# EAGLE design Pr0board_Lite_Main (EAGLE 9.6.2)
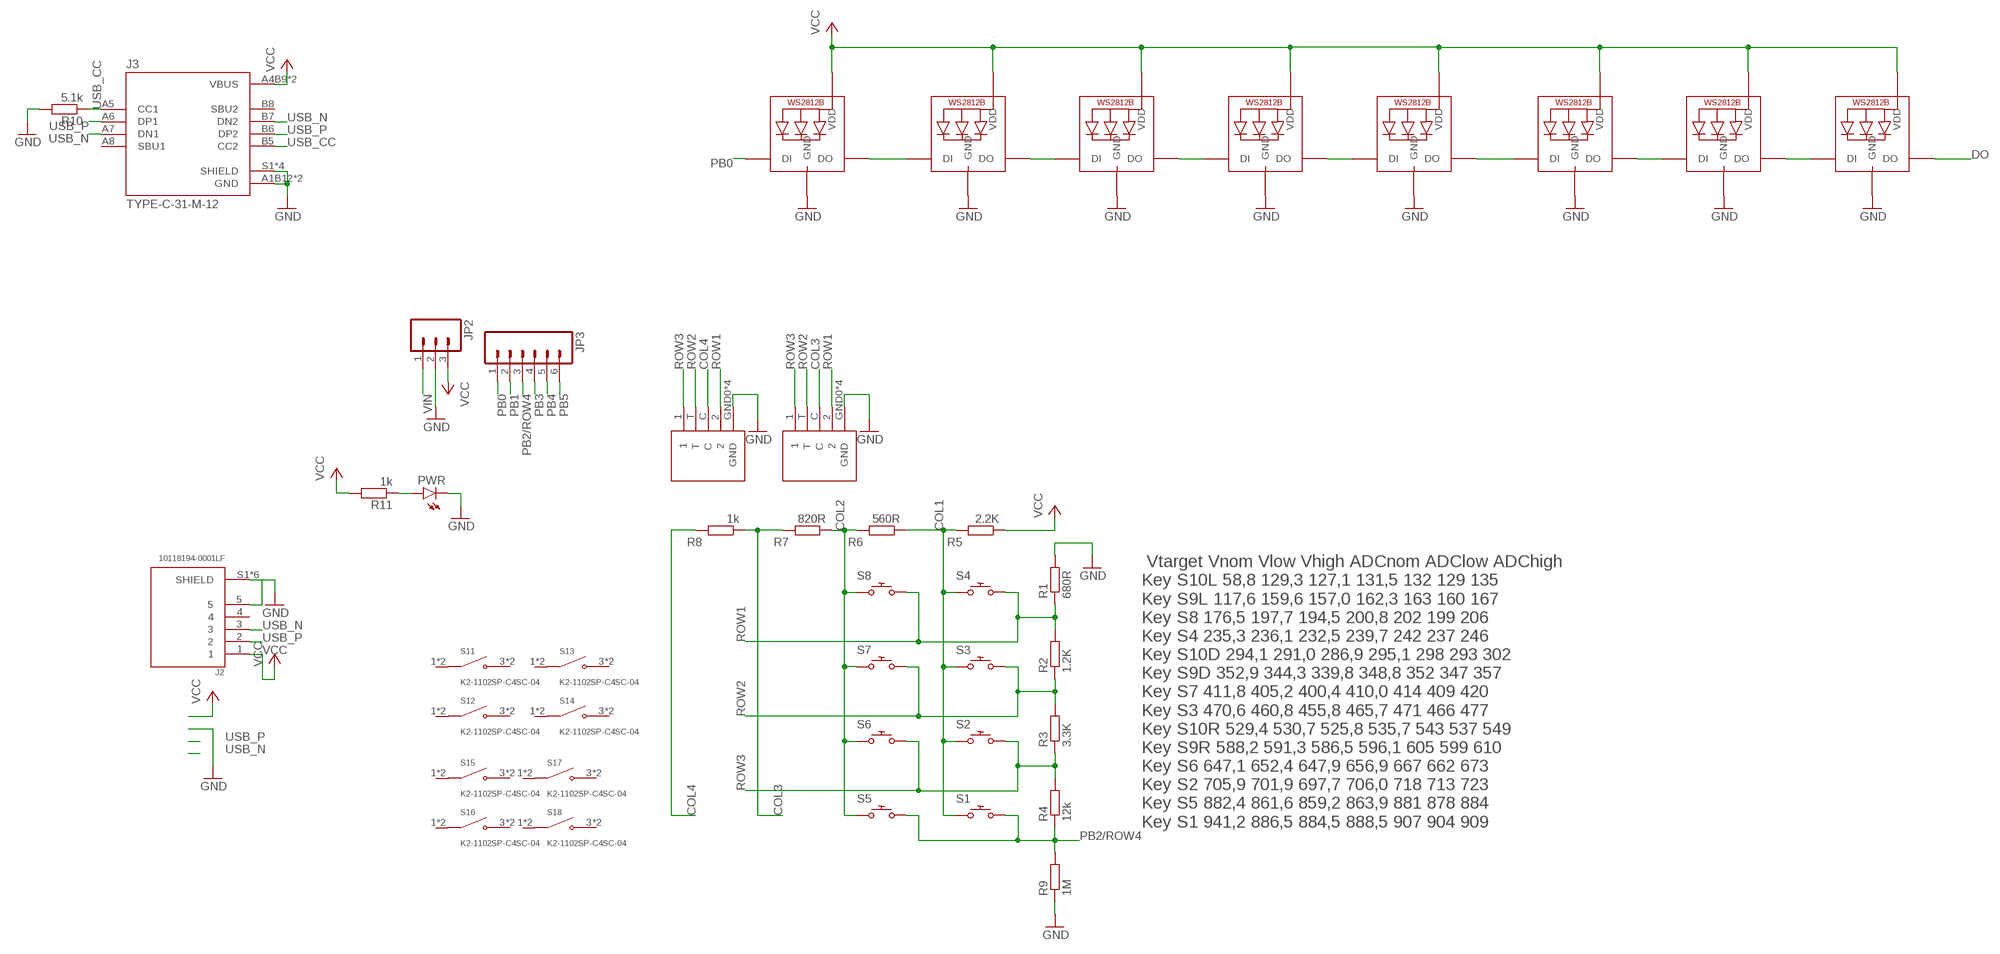
[diagram p0: schematic, sheet 1]

## Parts
J2  10118194-0001LF  [AMPHENOL_10118194-0001LF]
J3  TYPE-C-31-M-12  [HRO_TYPE-C-31-M-12]
JP2  M03PTH  [1X03]
JP3  M06SIP  [1X06]
LED1  WS2812B3535  [LED3535]
LED2  WS2812B3535  [LED3535]
LED3  WS2812B3535  [LED3535]
LED4  WS2812B3535  [LED3535]
LED5  WS2812B3535  [LED3535]
LED6  WS2812B3535  [LED3535]
LED7  WS2812B3535  [LED3535]
LED8  WS2812B3535  [LED3535]
PWR  LEDCHIP-LED0805  [CHIP-LED0805]
R1  680R  R-EU_R0805  [R0805]
R2  1.2K  R-EU_R0805  [R0805]
R3  3.3K  R-EU_R0805  [R0805]
R4  12k  R-EU_R0805  [R0805]
R5  2.2K  R-EU_R0805  [R0805]
R6  560R  R-EU_R0805  [R0805]
R7  820R  R-EU_R0805  [R0805]
R8  1k  R-EU_R0805  [R0805]
R9  1M  R-EU_R0805  [R0805]
R10  5.1k  R-EU_R0805  [R0805]
R11  1k  R-EU_R0805  [R0805]
S1  CPG151101S13 C404353  CHERRY_MX_LED  [CHERRY_MX_LED]
S2  CPG151101S13 C404353  CHERRY_MX_LED  [CHERRY_MX_LED]
S3  CPG151101S13 C404353  CHERRY_MX_LED  [CHERRY_MX_LED]
S4  CPG151101S13 C404353  CHERRY_MX_LED  [CHERRY_MX_LED]
S5  CPG151101S13 C404353  CHERRY_MX_LED  [CHERRY_MX_LED]
S6  CPG151101S13 C404353  CHERRY_MX_LED  [CHERRY_MX_LED]
S7  CPG151101S13 C404353  CHERRY_MX_LED  [CHERRY_MX_LED]
S8  CPG151101S13 C404353  CHERRY_MX_LED  [CHERRY_MX_LED]
S9  TM-2024A  [TM-2024A]
S10  TM-2024A  [TM-2024A]
S11  K2-1102SP-C4SC-04  2-1437565-9  [SW_2-1437565-9]
S12  K2-1102SP-C4SC-04  2-1437565-9  [SW_2-1437565-9]
S13  K2-1102SP-C4SC-04  2-1437565-9  [SW_2-1437565-9]
S14  K2-1102SP-C4SC-04  2-1437565-9  [SW_2-1437565-9]
S15  K2-1102SP-C4SC-04  2-1437565-9  [SW_2-1437565-9]
S16  K2-1102SP-C4SC-04  2-1437565-9  [SW_2-1437565-9]
S17  K2-1102SP-C4SC-04  2-1437565-9  [SW_2-1437565-9]
S18  K2-1102SP-C4SC-04  2-1437565-9  [SW_2-1437565-9]

## Nets
COL1: R5.2 R6.1 S1.S1 S2.S1 S3.S1 S4.S1
COL2: R6.2 R7.1 S5.S1 S6.S1 S7.S1 S8.S1
COL3: R7.2 R8.1 S9.C
COL4: R8.2 S10.C
DO: LED7.2(DO)
GND: J2.5 J2.S1(SHIELD) J2.S2(SHIELD) J2.S3(SHIELD) J2.S4(SHIELD) J2.S5(SHIELD) J2.S6(SHIELD) J3.A1B12(GND) J3.B1A12(GND) J3.S1(SHIELD) J3.S2(SHIELD) J3.S3(SHIELD) J3.S4(SHIELD) JP2.2 LED1.3(GND) LED2.3(GND) LED3.3(GND) LED4.3(GND) LED5.3(GND) LED6.3(GND) LED7.3(GND) LED8.3(GND) PWR.C R1.2 R9.1 R10.2 S9.GND0(GND) S9.GND1(GND) S9.GND2(GND) S9.GND3(GND) S10.GND0(GND) S10.GND1(GND) S10.GND2(GND) S10.GND3(GND)
N$4: LED1.2(DO) LED3.4(DI)
N$7: LED4.2(DO) LED5.4(DI)
N$8: LED1.4(DI) LED2.2(DO)
N$10: LED3.2(DO) LED4.4(DI)
N$12: PWR.A R11.1
N$13: LED5.2(DO) LED6.4(DI)
N$14: LED6.2(DO) LED8.4(DI)
N$15: LED7.4(DI) LED8.2(DO)
PB0: JP3.1 LED2.4(DI)
PB1: JP3.2
PB2/ROW4: JP3.3 R4.1 R9.2 S1.S2 S5.S2
PB3: JP3.4
PB4: JP3.5
PB5: JP3.6
ROW1: R1.1 R2.2 S4.S2 S8.S2 S9.2 S10.2
ROW2: R2.1 R3.2 S3.S2 S7.S2 S9.T S10.T
ROW3: R3.1 R4.2 S2.S2 S6.S2 S9.1 S10.1
USB_CC: J3.A5(CC1) J3.B5(CC2) R10.1
USB_N: J2.3 J3.A7(DN1) J3.B7(DN2)
USB_P: J2.2 J3.A6(DP1) J3.B6(DP2)
VCC: J2.1 J3.A4B9(VBUS) J3.B4A9(VBUS) JP2.3 LED1.1(VDD) LED2.1(VDD) LED3.1(VDD) LED4.1(VDD) LED5.1(VDD) LED6.1(VDD) LED7.1(VDD) LED8.1(VDD) R5.1 R11.2
VIN: JP2.1
Unconnected: J2.4 J3.A8(SBU1) J3.B8(SBU2) S11.1(COM) S11.2(COM) S11.3(NO) S11.4(NO) S12.1(COM) S12.2(COM) S12.3(NO) S12.4(NO) S13.1(COM) S13.2(COM) S13.3(NO) S13.4(NO) S14.1(COM) S14.2(COM) S14.3(NO) S14.4(NO) S15.1(COM) S15.2(COM) S15.3(NO) S15.4(NO) S16.1(COM) S16.2(COM) S16.3(NO) S16.4(NO) S17.1(COM) S17.2(COM) S17.3(NO) S17.4(NO) S18.1(COM) S18.2(COM) S18.3(NO) S18.4(NO)

## Notes on the sheet
- Vtarget Vnom Vlow Vhigh ADCnom ADClow ADChigh
  Key S10L 58,8 129,3 127,1 131,5 132 129 135
  Key S9L 117,6 159,6 157,0 162,3 163 160 167
  Key S8 176,5 197,7 194,5 200,8 202 199 206
  Key S4 235,3 236,1 232,5 239,7 242 237 246
  Key S10D 294,1 291,0 286,9 295,1 298 293 302
  Key S9D 352,9 344,3 339,8 348,8 352 347 357
  Key S7 411,8 405,2 400,4 410,0 414 409 420
  Key S3 470,6 460,8 455,8 465,7 471 466 477
  Key S10R 529,4 530,7 525,8 535,7 543 537 549
  Key S9R 588,2 591,3 586,5 596,1 605 599 610
  Key S6 647,1 652,4 647,9 656,9 667 662 673
  Key S2 705,9 701,9 697,7 706,0 718 713 723
  Key S5 882,4 861,6 859,2 863,9 881 878 884
  Key S1 941,2 886,5 884,5 888,5 907 904 909

## Library data of the parts
J2 = 10118194-0001LF:10118194-0001LF: Micro Usb, 2.0 Type b, Rcpt, Smt Check prices <https://pricing.snapeda.com/parts/10118194-0001LF/Amphenol%20ICC%20%28FCI%29/view-part?ref=eda>; AVAILABILITY: Good; DESCRIPTION: USB - micro B USB 2.0 Receptacle Connector 5 Position Surface Mount, Right Angle; Through Hole; MF: Amphenol ICC (FCI); MP: 10118194-0001LF; PACKAGE: None; PRICE: None; PURCHASE-URL: https://pricing.snapeda.com/search/part/10118194-0001LF/?ref=eda
J3 = TYPE-C-31-M-12:TYPE-C-31-M-12: USB Connectors 24 Receptacle 1 8.94*7.3mm RoHS; AVAILABILITY: Unavailable; DESCRIPTION: USB Connectors 24 Receptacle 1 8.94*7.3mm RoHS; MF: HRO Electronics Co., Ltd.; MP: TYPE-C-31-M-12; PACKAGE: Package; PRICE: None
JP2 = SparkFun:M03: Header 3 Standard 3-pin 0.1" header. Use with straight break away headers (SKU : PRT-00116), right angle break away headers (PRT-00553), swiss pins (PRT-00743), machine pins (PRT-00117), and female headers (PRT-00115). Molex polarized connector foot print use with SKU : PRT-08232 with associated crimp pins and housings.
JP3 = SparkFun:M06: Header 6 Standard 6-pin 0.1" header. Use with straight break away headers (SKU : PRT-00116), right angle break away headers (PRT-00553), swiss pins (PRT-00743), machine pins (PRT-00117), and female headers (PRT-00115). Molex polarized connector foot print use with SKU : PRT-08094 with associated crimp pins and housings. NOTES ON THE VARIANTS LOCK and LOCK_LONGPADS... This footprint was designed to help hold the alignment of a through-hole component (i.e. 6-pin header) while soldering it into place. You may notice that each hole has been shifted either up or down by 0.005 of an inch from it's more standard position (which is a perfectly straight line). This slight alteration caused the pins (the squares in the middle) to touch the edges of the holes. Because they are alternating, it causes a "brace" to hold the component in place. 0.005 has proven to be the perfect amount of "off-center" position when using our standard breakaway headers. Although looks a little odd when you look at the bare footprint, once you have a header in there, the alteration is very hard to notice. Also, if you push a header all the way into place, it is covered up entirely on the bottom side. This idea of altering the position of holes to aid alignment will be further integrated into the Sparkfun Library for other footprints. It can help hold any component with 3 or more connection pins.
LED1-LED8 = adafruit:WS2812B
PWR = led:LED: LED OSRAM: - CHIPLED LG R971, LG N971, LY N971, LG Q971, LY Q971, LO R971, LY R971 LH N974, LH R974 LS Q976, LO Q976, LY Q976 LO Q996 - Hyper CHIPLED LW Q18S LB Q993, LB Q99A, LB R99A - SideLED LS A670, LO A670, LY A670, LG A670, LP A670 LB A673, LV A673, LT A673, LW A673 LH A674 LY A675 LS A676, LA A676, LO A676, LY A676, LW A676 LS A679, LY A679, LG A679 - Hyper Micro SIDELED® LS Y876, LA Y876, LO Y876, LY Y876 LT Y87S - SmartLED LW L88C, LW L88S LB L89C, LB L89S, LG L890 LS L89K, LO L89K, LY L89K LS L896, LA L896, LO L896, LY L896 - TOPLED LS T670, LO T670, LY T670, LG T670, LP T670 LSG T670, LSP T670, LSY T670, LOP T670, LYG T670 LG T671, LOG T671, LSG T671 LB T673, LV T673, LT T673, LW T673 LH T674 LS T676, LA T676, LO T676, LY T676, LB T676, LH T676, LSB T676, LW T676 LB T67C, LV T67C, LT T67C, LS T67K, LO T67K, LY T67K, LW E67C LS E67B, LA E67B, LO E67B, LY E67B, LB E67C, LV E67C, LT E67C LW T67C LS T679, LY T679, LG T679 LS T770, LO T770, LY T770, LG T770, LP T770 LB T773, LV T773, LT T773, LW T773 LH T774 LS E675, LA E675, LY E675, LS T675 LS T776, LA T776, LO T776, LY T776, LB T776 LHGB T686 LT T68C, LB T68C - Hyper Mini TOPLED® LB M676 - Mini TOPLED Santana® LG M470 LS M47K, LO M47K, LY M47K Source: http://www.osram.convergy.de LUXEON: - LUMILED® LXK2-PW12-R00, LXK2-PW12-S00, LXK2-PW14-U00, LXK2-PW14-V00 LXK2-PM12-R00, LXK2-PM12-S00, LXK2-PM14-U00 LXK2-PE12-Q00, LXK2-PE12-R00, LXK2-PE12-S00, LXK2-PE14-T00, LXK2-PE14-U00 LXK2-PB12-K00, LXK2-PB12-L00, LXK2-PB12-M00, LXK2-PB14-N00, LXK2-PB14-P00, LXK2-PB14-Q00 LXK2-PR12-L00, LXK2-PR12-M00, LXK2-PR14-Q00, LXK2-PR14-R00 LXK2-PD12-Q00, LXK2-PD12-R00, LXK2-PD12-S00 LXK2-PH12-R00, LXK2-PH12-S00 LXK2-PL12-P00, LXK2-PL12-Q00, LXK2-PL12-R00 Source: www.luxeon.com KINGBRIGHT: KA-3528ASYC Source: www.kingbright.com
R1-R11 = rcl:R-EU_: RESISTOR, European symbol; SPICEPREFIX: R
S1-S8 = cherry:CHERRY_MX_LED: Cherry MX with LED; FARNELL: 2292961; MOUSER: 540_MX1A_11NW
S9 S10 = TM-2024A:TM-2024A
S11-S18 = 2-1437565-9:2-1437565-9: Check prices <https://pricing.snapeda.com/parts/2-1437565-9/TE%20Connectivity/view-part?ref=eda>; AVAILABILITY: Good; COMMENT: 2-1437565-9; DESCRIPTION: Tactile Switch SPST-NO Top Actuated Surface Mount; MF: TE Connectivity; MP: 2-1437565-9; PACKAGE: SMD-6 Omron Electronics; PRICE: None

## Board
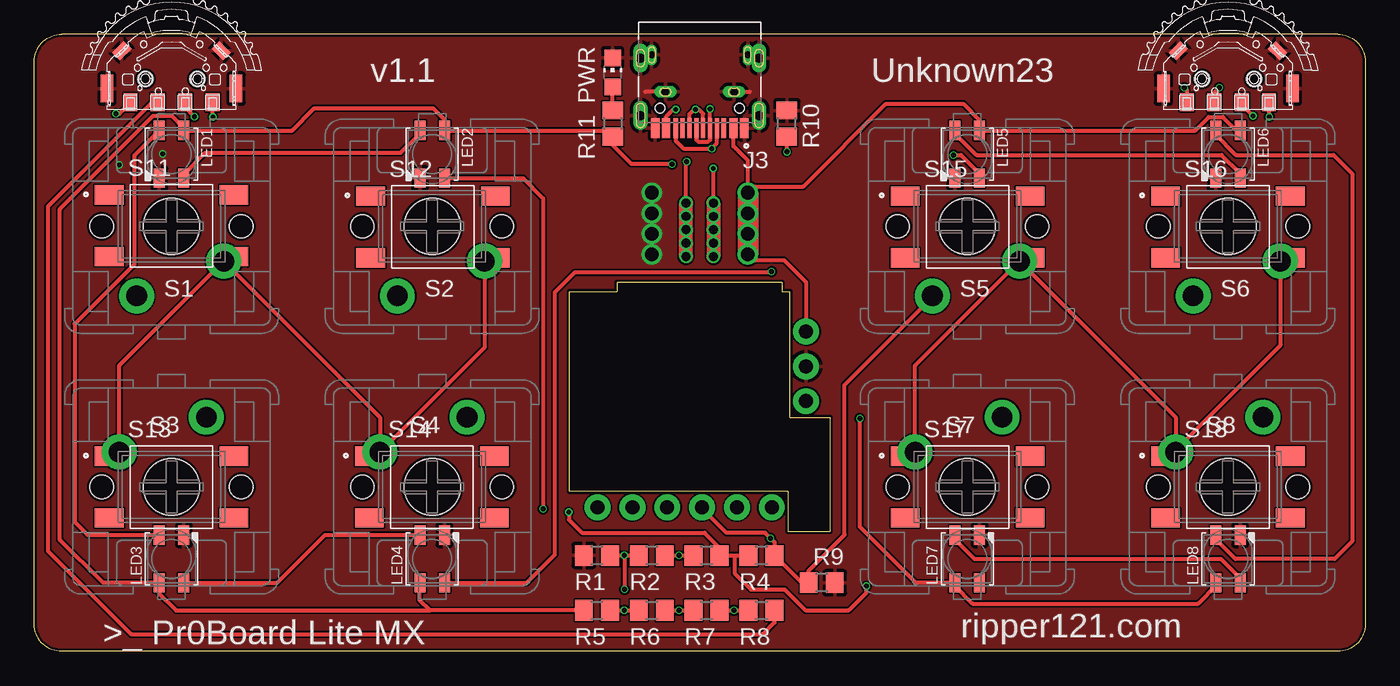
[diagram p1: board, top side]
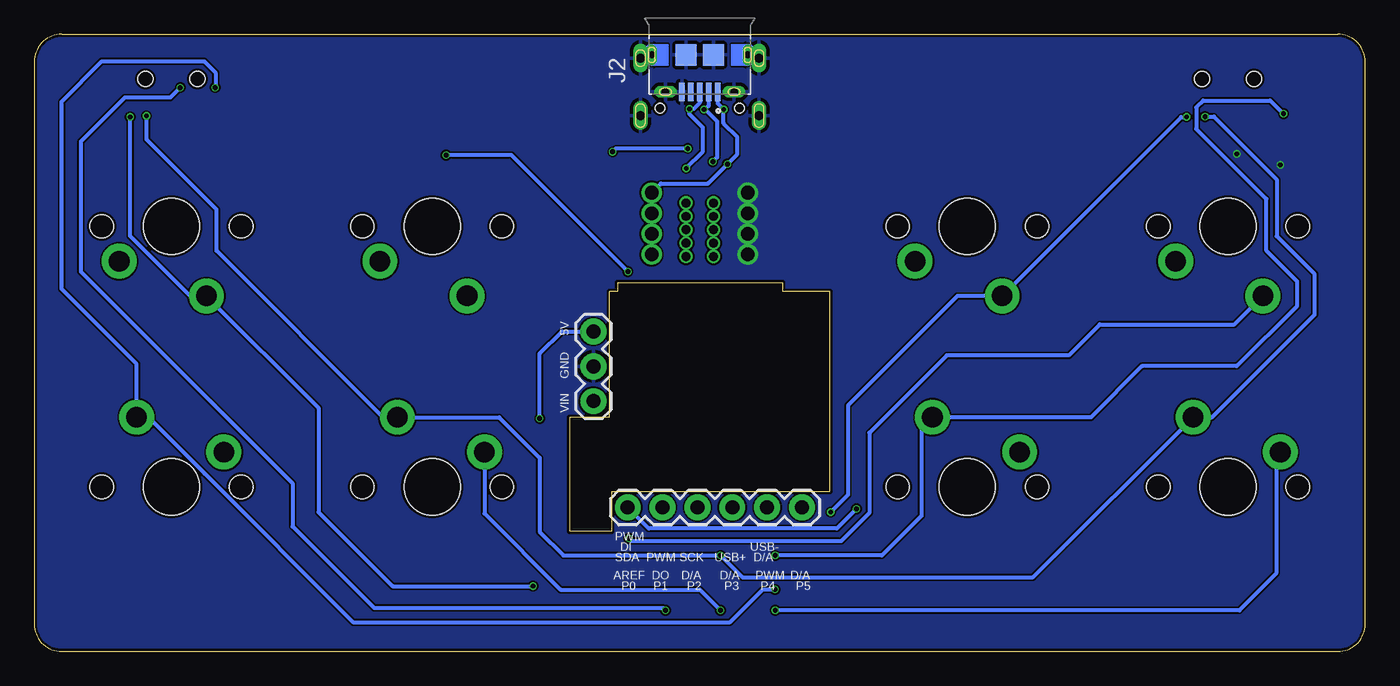
[diagram p2: board, bottom side, seen from below]

Size 97 x 45 mm. Coordinates in mm from the lower left corner, seen from the top.
Outline: 95,45 2,45 arc90 0,43 0,2 arc90 2,0 95,0 arc90 97,2 97,43 arc90 95,45
Outline: 54.92,11.67 39,11.67 39,26.25 42.47,26.25 42.47,26.9 54.5,26.9 54.5,26.25 55.08,26.25 55.08,17.08 58,17.08 58,8.75 54.92,8.75 54.92,11.67
Copper layers (1*16): Top 0.035559375mm / dielectric 1.6mm / Bottom 0.035559375mm
Design rules "jlcpcb2layer": minimum track width 5mil, minimum drill 12mil, track to track 5mil, track to pad 5mil, pad to pad 5mil, via to via 5mil, smd to smd 5mil, copper to edge 8mil, drill to drill 6mil, minimum pad ring 5mil, minimum via ring 3mil, stop-mask expansion 2.5mil, vias tented up to drill 0mil, thermal gap 10mil

### Footprints (pad centres in the part's own frame; a part is rotated, then mirrored left to right if it is on the bottom)
AMPHENOL_10118194-0001LF = smd 0.4 x 1.35: 1 -1.3,2.7; 2 -0.65,2.7; 3 0,2.7; 4 0.65,2.7; 5 1.3,2.7 | drill 0.55 pad 0.65 long: S1 -2.5,2.7; S2 2.5,2.7 | drill 0.5 pad 0.775 long: S3 -3.5,0; S6 3.5,0 | smd 1.5 x 1.55: S4 -1,0; S5 1,0
HRO_TYPE-C-31-M-12 = smd 0.6 x 1.45: A1B12 -3.25,5.095; A4B9 -2.45,5.095; B1A12 3.25,5.095; B4A9 2.45,5.095 | smd 0.3 x 1.45: A5 -1.25,5.095; A6 -0.25,5.095; A7 0.25,5.095; A8 1.25,5.095; B5 1.75,5.095; B6 0.75,5.095; B7 -0.75,5.095; B8 -1.75,5.095 | drill 0.65 pad 1.05 long: S1 -4.32,4.18; S2 4.32,4.18; S3 -4.32,0; S4 4.32,0 | hole 0.7: -2.89,3.65; 2.89,3.65
1X03 = drill 1.016 pad 1.88: 1 0,0; 2 2.54,0; 3 5.08,0
1X06 = drill 1.016 pad 1.88: 1 0,0; 2 2.54,0; 3 5.08,0; 4 7.62,0; 5 10.16,0; 6 12.7,0
LED3535 = smd 1.4 x 0.8: 1 -1.74,0.89; 2 -1.74,-0.89; 3 1.74,-0.89; 4 1.74,0.89
CHIP-LED0805 = smd 1.2 x 1.2: A 0,-1.05; C 0,1.05
R0805 = smd 1.3 x 1.5: 1 -0.95,0; 2 0.95,0
CHERRY_MX_LED = drill 1.5 pad 2.54: S1 -3.81,2.54; S2 2.54,5.08 | hole 1.7: -5.08,0; 5.08,0 | hole 4.1: 0,0
TM-2024A = smd 1 x 1.3: 1 3,-0.95; 2 -3,-0.95; C -1,-0.95; T 1,-0.95 | smd 0.9 x 2: GND0 -4.7,0.05; GND3 4.7,0.05 | smd 1.2 x 0.8 rotated 45: GND1 -3.62,2.8 | smd 1.2 x 0.8 rotated 315: GND2 3.62,2.8 | hole 1.1: -1.9,0.75; 1.9,0.75
SW_2-1437565-9 = smd 2.1 x 1.4: 1 -4.55,2.25; 2 4.55,2.25; 3 -4.55,-2.25; 4 4.55,-2.25

### Placement (x,y rotation side)
J2  48.5,43.5 180 bottom
J3  48.5,43.26 180 top
JP2  56.25,18.25 90 bottom
JP3  53.75,10.5 0 bottom
LED1  10,36.25 270 top
LED2  29,36.25 270 top
LED3  10,6.75 90 top
LED4  29,6.75 90 top
LED5  68,36.25 270 top
LED6  87,36.25 270 top
LED7  68,6.75 90 top
LED8  87,6.75 90 top
PWR  42.15,42.23 0 top
R1  41,7 180 top
R2  45,7 180 top
R3  49,7 180 top
R4  53,7 180 top
R5  41,3 0 top
R6  45,3 0 top
R7  49,3 0 top
R8  53,3 0 top
R9  57.39,5.02 180 top
R10  54.85,38.5 90 top
R11  42.15,38.5 270 top
S1  10,31 180 top
S2  29,31 180 top
S3  10,12 0 top
S4  29,12 0 top
S5  68,31 180 top
S6  87,31 180 top
S7  68,12 0 top
S8  87,12 0 top
S9  87,41 0 top
S10  10,41 0 top
S11  10,31.04 0 top
S12  29.05,30.96 0 top
S13  10,11.99 0 top
S14  28.97,11.99 0 top
S15  68.02,30.96 0 top
S16  87,30.96 0 top
S17  68.02,11.99 0 top
S18  87,11.99 0 top

### Tracks (layer width: path | path; a pad name or v marks a point on that pad's centre or on a via)
COL1  (via drill 0.35)
  Top 0.305: R5.2 v43,3 R6.1 | S3.S1 6.19,20.84 S1.S1 25.19,17.08 S4.S1 32.81,22.16 S2.S1
  Bottom 0.305: S3.S1 6.48,14.25 6.48,5.68 9.17,3 v43,3
COL2  (via drill 0.35)
  Top 0.305: R6.2 v46.99,3 R7.1 | S7.S1 64.19,20.84 S5.S1 83.19,17.08 83.19,14.68 | 83.19,14.68 S8.S1 | S6.S1 90.81,22.3 83.19,14.68
  Bottom 0.305: S7.S1 64.19,10.06 58.64,4.51 48.5,4.51 v46.99,3
COL3  (via drill 0.35)
  Top 0.305: R7.2 v51,3 R8.1 | S9.C 86,40.76 v86.36,41.12
  Bottom 0.305: v86.36,41.12 87.09,40.39 90.39,40.39 93.6,37.18 93.6,27.7 78.17,12.27 78.17,9.12 72.23,3.17 51.17,3.17 v51,3
COL4
  Top 0.305: R8.2 53.95,2.12 53.1,1.27 7.06,1.27 1,7.34 1,32.44 8.6,40.05 S10.C
GND  (via drill 0.35, 1)
  Top 0.305: J2.S2 52.15,40.8 | J2.S1 44.53,40.8
  other vias: 45,33.45 45,31.95 45,28.95 45,30.45 6.19,35.48 9.37,36.27
  pour Top: 102,46 -5.36,46 -5.36,-2.88 102,-2.88
  pour Bottom: 102,46 -5.36,46 -5.36,-2.88 102,-2.88
N$4
  Top 0.305: LED1.2 7.28,36.16 7.28,28.23 2.94,23.88 2.94,9.45 3.89,8.49 LED3.4
N$7  (via drill 0.35)
  Top 0.305: LED4.2 35.89,5.01 37.94,7.06 37.94,26.19 39.37,27.62 53.66,27.62 v53.74,27.7 | v66.99,36.2 67.55,36.2 68.89,34.85 LED5.4
  Bottom 0.305: v53.74,27.7 62.23,36.2 v66.99,36.2
N$8
  Top 0.305: LED1.4 10.89,34.78 12.46,36.35 26.71,36.35 28.11,37.75 LED2.2
N$10
  Top 0.305: LED3.2 17.71,5.01 21.19,8.49 LED4.4
N$12
  Top 0.305: R11.1 PWR.A
N$13
  Top 0.305: LED5.2 67.11,37.75 68.67,36.2 86.52,36.2 87.89,34.83 LED6.4
N$14
  Top 0.305: LED6.2 86.11,37.67 87.59,36.2 94.69,36.2 96.04,34.85 96.04,8.02 94.77,6.75 87.54,6.75 86.11,8.17 LED8.4
N$15
  Top 0.305: LED7.4 67.11,8.17 68.54,6.75 86.47,6.75 87.89,5.33 LED8.2
PB0  (via drill 0.35)
  Top 0.305: LED2.4 35.61,34.51 37.08,33.04 v37.08,10.4
  Bottom 0.305: v37.08,10.4 38.51,8.97 52.23,8.97 JP3.1
PB2/ROW4  (via drill 0.35)
  Top 0.305: JP3.3 48.67,10.42 50.44,8.65 53.26,8.65 v53.66,8.26 53.95,7.96 R4.1 55.93,5.02 R9.2 56.44,5.89 59.05,8.51 59.05,19.45 65.46,25.85 S5.S2
  Bottom 0.305: S1.S2 9.52,23.86 19.35,23.86 21.61,21.59 30.49,21.59 36.14,15.94 36.14,10.09 38.18,8.06 53.46,8.06 v53.66,8.26
ROW1  (via drill 0.35)
  Top 0.305: R1.1 v43,7 | v43,7 R2.2 | v5.95,39.21 6.19,39.21 7,40.02 S10.2 | v43.02,4.52 43,4.54 v43,7 | v83.82,41.12 84,40.94 S9.2
  Bottom 0.305: v5.95,39.21 6.92,40.18 11.81,40.18 12.32,39.67 12.32,38.1 7.2,32.98 7.2,29.23 4.96,26.98 4.96,25.2 9.36,20.8 16.27,20.8 19.99,17.08 S4.S2 32.33,16.29 32.33,9.89 35.23,7 v43,7 | v43.02,4.52 43.91,4.52 46.29,2.14 73.77,2.14 84.59,12.97 84.59,13 88.62,17.02 89.48,17.02 S8.S2 89.54,20.96 95.01,26.43 95.01,40.08 92.08,43.02 84.61,43.02 83.8,42.2 83.8,41.14 v83.82,41.12
ROW2  (via drill 0.35)
  Top 0.305: R2.1 v46.99,7 R3.2 | v11.67,39 11,39.67 S10.T | v88.82,39.05 88,39.87 S9.T
  Bottom 0.305: v11.67,39 11.03,39 6.45,34.42 6.45,30.28 3.69,27.51 3.69,24.56 11.17,17.08 S3.S2 24.21,5.41 45.4,5.41 v46.99,7 58.44,7 60.17,8.73 60.17,14.13 63.12,17.08 S7.S2 71.57,17.08 83.72,29.23 83.72,32.23 88.82,37.33 v88.82,39.05
ROW3  (via drill 0.35)
  Top 0.305: 51.04,7 R3.1 49.95,7.56 48.85,8.65 39.91,8.65 38.96,9.6 v38.96,10.16 | 51.04,7 R4.2 | v13.02,38.97 13,38.99 S10.1 | v90.01,38.97 S9.1 | 51.04,7 51.04,5.71 52.23,4.52 54.69,4.52 56.2,3.02 59.37,3.02 60.64,4.29 v60.64,4.76
  Bottom 0.305: v13.02,38.97 13.41,38.97 S2.S2 29.71,25.92 37.69,17.95 37.69,11.43 v38.96,10.16 | v90.01,38.97 90.01,30.29 85.61,25.9 84.48,25.9 S6.S2 76.28,17.74 76.28,10.16 70.88,4.76 v60.64,4.76
USB_CC  (via drill 0.35)
  Top 0.305: J3.B5 46.75,37.23 47.31,36.67 49.34,36.67 49.37,36.7 | J3.A5 49.75,37.08 49.37,36.7 | v54.85,36.43 R10.1 | v49.37,36.67 49.37,36.7
  Bottom 0.305: v49.37,36.67 54.61,36.67 v54.85,36.43
USB_N  (via drill 0.35, 0.65)
  Top 0.305: v49.5,32.7 49.5,35.19 v49.48,35.22 | v49.24,39.55 v49.25,39.54 J3.B7 49.25,37.32 49.08,37.15 48.42,37.15 48.25,37.32 J3.A7
  Top 1.016: v49.5,32.7 v49.5,31.73 v49.5,30.75 v49.5,29.77 v49.5,28.8
  Bottom 0.305: J2.3 48.5,40.02 48.96,39.55 v49.24,39.55 49.24,39.16 48.27,38.19 48.27,36.45 v49.49,35.23 v49.48,35.22
USB_P  (via drill 0.35, 0.65)
  Top 0.305: J3.B6 47.75,39.17 48.1,39.53 v48.18,39.53 48.42,39.53 48.75,39.2 J3.A6 | v47.5,32.7 47.5,35.67 v47.55,35.72
  Top 1.016: v47.5,28.8 v47.5,29.77 v47.5,30.75 v47.5,31.73 v47.5,32.7
  Bottom 0.305: J2.2 47.85,39.78 48.1,39.53 | v48.18,39.53 48.1,39.53 | v47.55,35.72 47.23,36.04 47.23,38.66 48.1,39.53
VCC  (via drill 0.35, 1)
  Top 0.305: v52,28.95 52.42,28.53 54.65,28.53 56.25,26.92 JP2.3 | v46.49,35.53 46.51,35.56 43.5,35.56 42.15,36.91 R11.2 41.7,37.99 LED2.1 29.89,38.78 29.07,39.61 20.4,39.61 18.78,37.99 LED1.1 10.89,38.16 10,39.05 8.68,39.05 1.87,32.24 1.87,8.16 5.02,5.01 LED3.1 9.11,4.22 10.33,3 28.83,3 | R5.1 28.83,3 | 28.83,3 28.1,3.73 28.1,5 LED4.1 | LED8.1 86.11,4.77 84.83,3.49 68.39,3.49 67.11,4.77 LED7.1 64.25,5.01 60.17,9.1 v60.17,16.99 | LED6.1 87.61,37.99 86.63,38.97 85.59,38.97 84.61,37.99 LED5.1 68.9,38.73 67.71,39.93 62.07,39.93 56.05,33.91 52.46,33.91 v52,33.45 52,35.79 50.95,36.84 J3.A4B9 | J3.B4A9 46.05,38.99 46.59,39.53 v46.75,39.53
  Top 1.524: v52,33.45 v52,31.95 v52,30.45 v52,28.95
  Bottom 0.305: J2.1 47.2,39.98 v46.75,39.53 46.75,38.5 45.8,37.54 45.8,36.22 v46.49,35.53 47.9,34.12 51.33,34.12 v52,33.45 | v60.17,16.99 60.17,21.72 58.55,23.33 JP2.3

### Text on the board
bPlace: PWM | D/A | USB- | USB+ | SCK | PWM | DI | SDA | D/A | PWM | D/A | D/A | DO | AREF
tNames: v1.1 | Unknown23 | ripper121.com | >_ Pr0Board Lite MX
bNames: 5V | GND | VIN | P5 | P4 | P3 | P2 | P1 | P0